# EAGLE design 7-saw-controller (EAGLE 6.4)
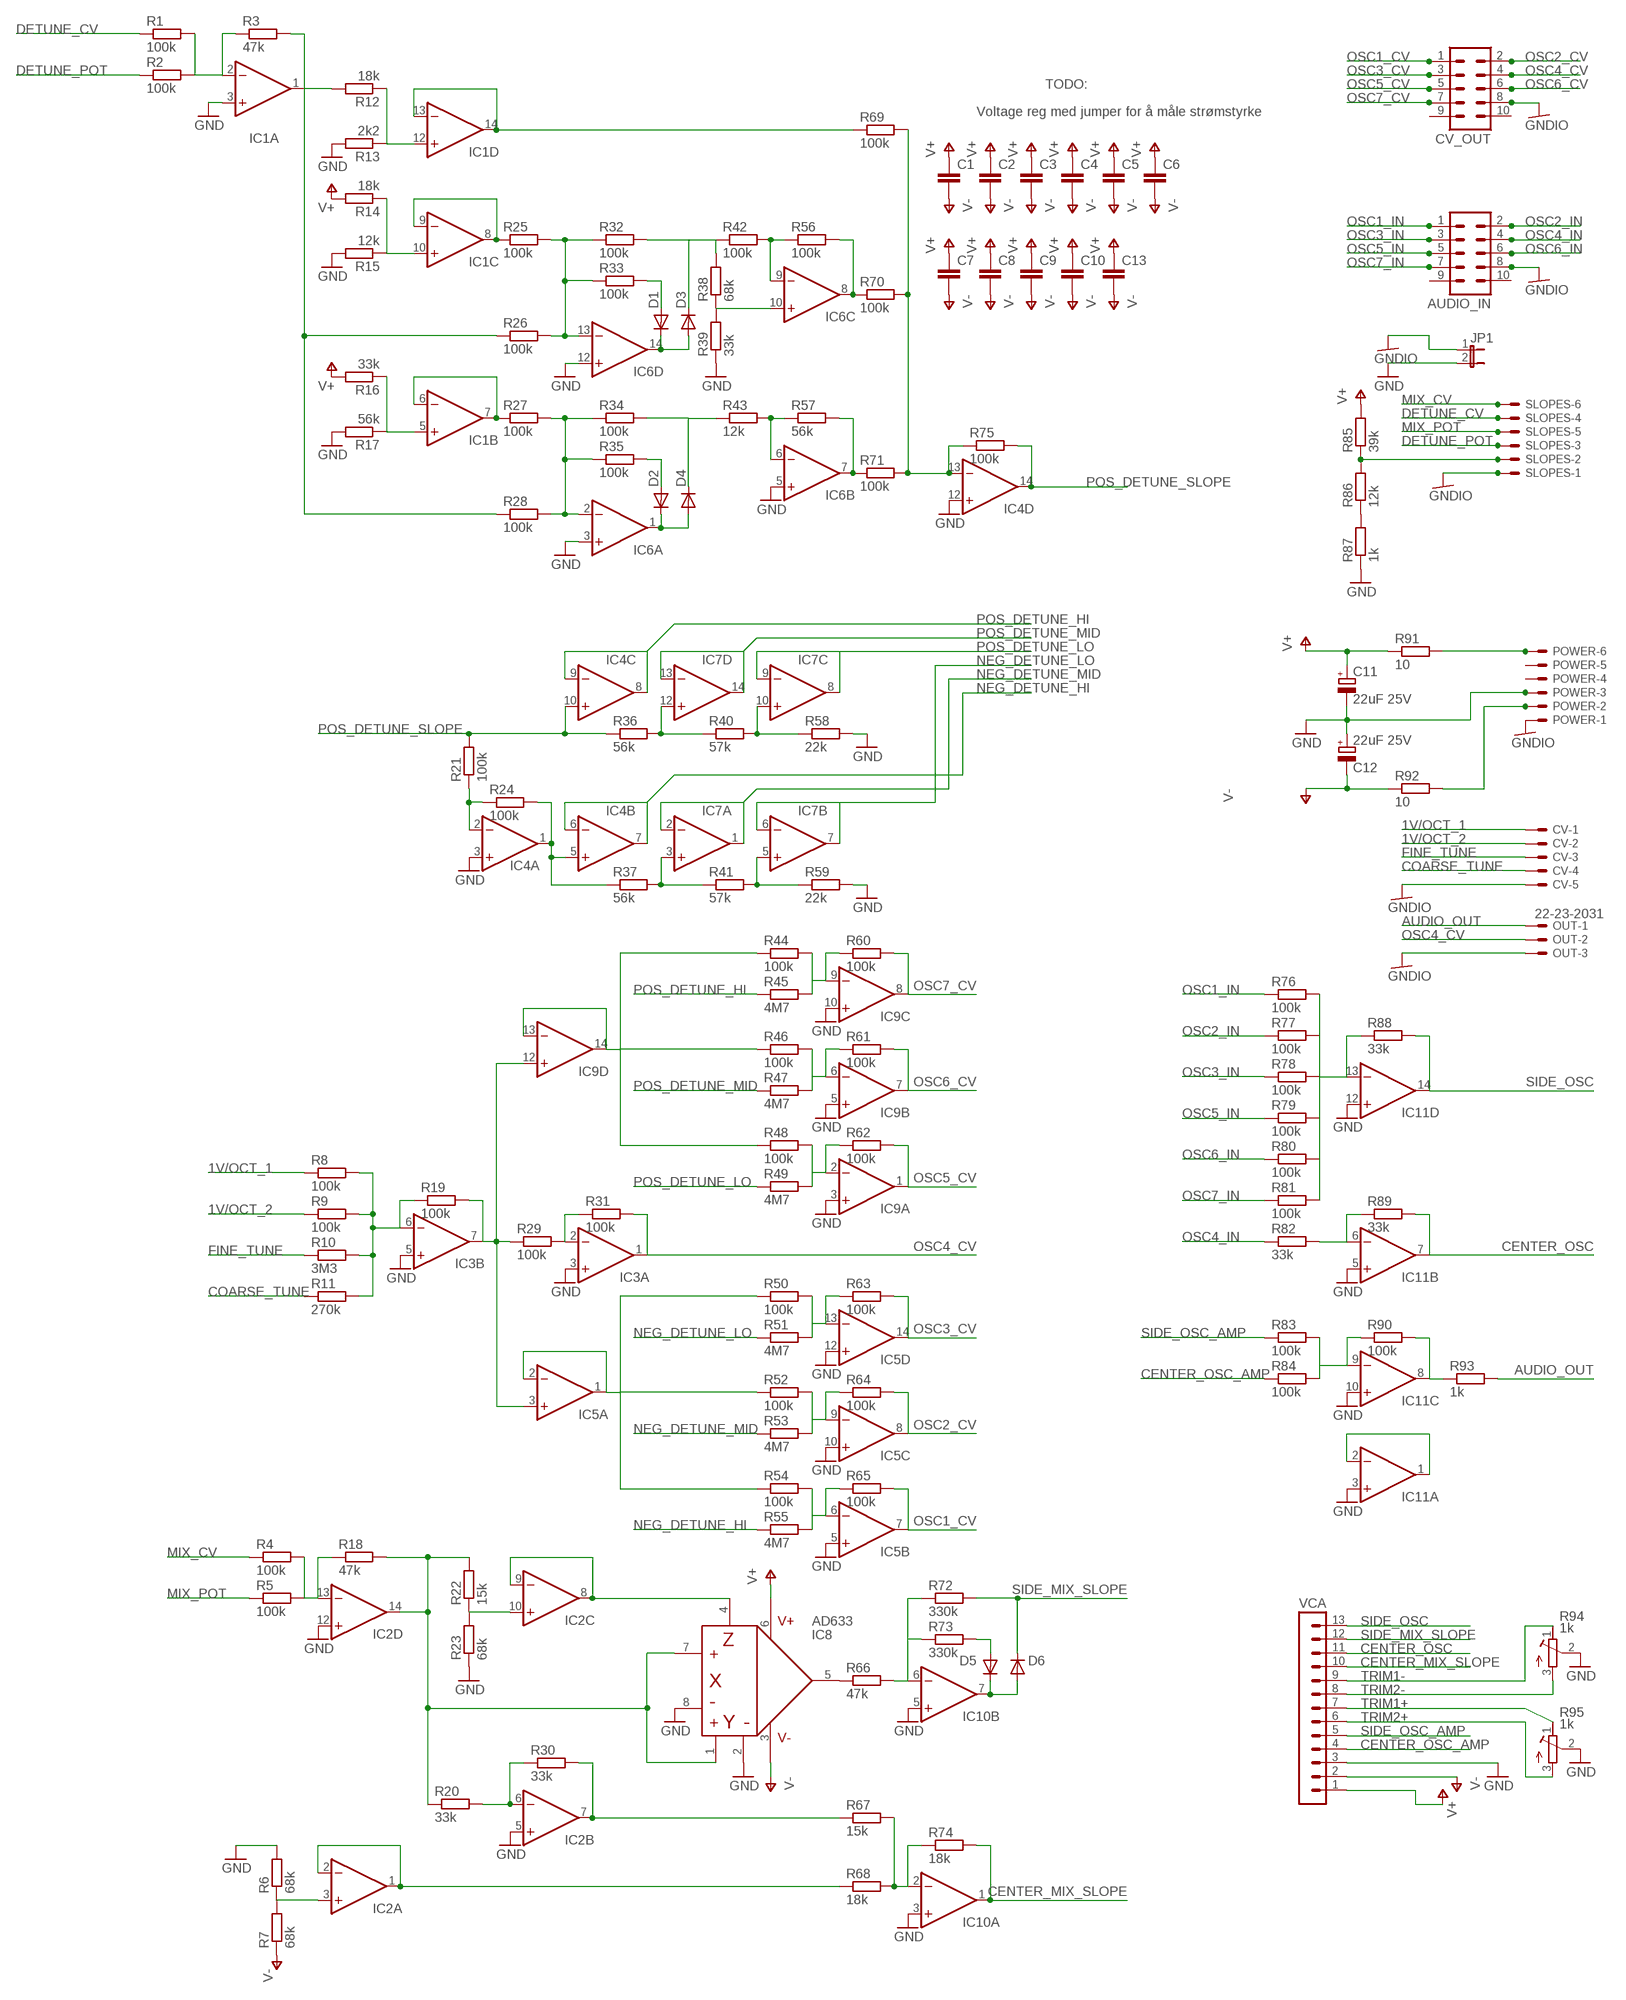
[diagram p0: schematic, sheet 1]

## Parts
AUDIO_IN  MA05-2  [MA05-2]
C1  C-EU025-024X044  [C025-024X044]
C2  C-EU025-024X044  [C025-024X044]
C3  C-EU025-024X044  [C025-024X044]
C4  C-EU025-024X044  [C025-024X044]
C5  C-EU025-024X044  [C025-024X044]
C6  C-EU025-024X044  [C025-024X044]
C7  C-EU025-024X044  [C025-024X044]
C8  C-EU025-024X044  [C025-024X044]
C9  C-EU025-024X044  [C025-024X044]
C10  C-EU025-024X044  [C025-024X044]
C11  22uF 25V  CPOL-EUE2-5  [E2-5]
C12  22uF 25V  CPOL-EUE2-5  [E2-5]
C13  C-EU025-024X044  [C025-024X044]
CV  22-23-2051  [22-23-2051]
CV_OUT  MA05-2  [MA05-2]
D1  DIODE-D-5  [D-5]
D2  DIODE-D-5  [D-5]
D3  DIODE-D-5  [D-5]
D4  DIODE-D-5  [D-5]
D5  DIODE-D-5  [D-5]
D6  DIODE-D-5  [D-5]
IC1  TL074D  [SO14]
IC2  TL074D  [SO14]
IC3  TL072D  [SO08]
IC4  TL074D  [SO14]
IC5  TL074D  [SO14]
IC6  TL074D  [SO14]
IC7  TL074D  [SO14]
IC8  AD633  [SO08]
IC9  TL074D  [SO14]
IC10  TL072D  [SO08]
IC11  TL074D  [SO14]
JP1  JP1E  [JP1]
OUT  22-23-2031  [22-23-2031]
POWER  22-23-2061  [22-23-2061]
R1  100k  R-EU_0204/5  [0204/5]
R2  100k  R-EU_0204/5  [0204/5]
R3  47k  R-EU_0204/5  [0204/5]
R4  100k  R-EU_0204/5  [0204/5]
R5  100k  R-EU_0204/5  [0204/5]
R6  68k  R-EU_0204/5  [0204/5]
R7  68k  R-EU_0204/5  [0204/5]
R8  100k  R-EU_0204/5  [0204/5]
R9  100k  R-EU_0204/5  [0204/5]
R10  3M3  R-EU_0204/5  [0204/5]
R11  270k  R-EU_0204/5  [0204/5]
R12  18k  R-EU_0204/5  [0204/5]
R13  2k2  R-EU_0204/5  [0204/5]
R14  18k  R-EU_0204/5  [0204/5]
R15  12k  R-EU_0204/5  [0204/5]
R16  33k  R-EU_0204/5  [0204/5]
R17  56k  R-EU_0204/5  [0204/5]
R18  47k  R-EU_0204/5  [0204/5]
R19  100k  R-EU_0204/5  [0204/5]
R20  33k  R-EU_0204/5  [0204/5]
R21  100k  R-EU_0204/5  [0204/5]
R22  15k  R-EU_0204/5  [0204/5]
R23  68k  R-EU_0204/5  [0204/5]
R24  100k  R-EU_0204/5  [0204/5]
R25  100k  R-EU_0204/5  [0204/5]
R26  100k  R-EU_0204/5  [0204/5]
R27  100k  R-EU_0204/5  [0204/5]
R28  100k  R-EU_0204/5  [0204/5]
R29  100k  R-EU_0204/5  [0204/5]
R30  33k  R-EU_0204/5  [0204/5]
R31  100k  R-EU_0204/5  [0204/5]
R32  100k  R-EU_0204/5  [0204/5]
R33  100k  R-EU_0204/5  [0204/5]
R34  100k  R-EU_0204/5  [0204/5]
R35  100k  R-EU_0204/5  [0204/5]
R36  56k  R-EU_0204/5  [0204/5]
R37  56k  R-EU_0204/5  [0204/5]
R38  68k  R-EU_0204/5  [0204/5]
R39  33k  R-EU_0204/5  [0204/5]
R40  57k  R-EU_0204/5  [0204/5]
R41  57k  R-EU_0204/5  [0204/5]
R42  100k  R-EU_0204/5  [0204/5]
R43  12k  R-EU_0204/5  [0204/5]
R44  100k  R-EU_0204/5  [0204/5]
R45  4M7  R-EU_0204/5  [0204/5]
R46  100k  R-EU_0204/5  [0204/5]
R47  4M7  R-EU_0204/5  [0204/5]
R48  100k  R-EU_0204/5  [0204/5]
R49  4M7  R-EU_0204/5  [0204/5]
R50  100k  R-EU_0204/5  [0204/5]
R51  4M7  R-EU_0204/5  [0204/5]
R52  100k  R-EU_0204/5  [0204/5]
R53  4M7  R-EU_0204/5  [0204/5]
R54  100k  R-EU_0204/5  [0204/5]
R55  4M7  R-EU_0204/5  [0204/5]
R56  100k  R-EU_0204/5  [0204/5]
R57  56k  R-EU_0204/5  [0204/5]
R58  22k  R-EU_0204/5  [0204/5]
R59  22k  R-EU_0204/5  [0204/5]
R60  100k  R-EU_0204/5  [0204/5]
R61  100k  R-EU_0204/5  [0204/5]
R62  100k  R-EU_0204/5  [0204/5]
R63  100k  R-EU_0204/5  [0204/5]
R64  100k  R-EU_0204/5  [0204/5]
R65  100k  R-EU_0204/5  [0204/5]
R66  47k  R-EU_0204/5  [0204/5]
R67  15k  R-EU_0204/5  [0204/5]
R68  18k  R-EU_0204/5  [0204/5]
R69  100k  R-EU_0204/5  [0204/5]
R70  100k  R-EU_0204/5  [0204/5]
R71  100k  R-EU_0204/5  [0204/5]
R72  330k  R-EU_0204/5  [0204/5]
R73  330k  R-EU_0204/5  [0204/5]
R74  18k  R-EU_0204/5  [0204/5]
R75  100k  R-EU_0204/5  [0204/5]
R76  100k  R-EU_0204/5  [0204/5]
R77  100k  R-EU_0204/5  [0204/5]
R78  100k  R-EU_0204/5  [0204/5]
R79  100k  R-EU_0204/5  [0204/5]
R80  100k  R-EU_0204/5  [0204/5]
R81  100k  R-EU_0204/5  [0204/5]
R82  33k  R-EU_0204/5  [0204/5]
R83  100k  R-EU_0204/5  [0204/5]
R84  100k  R-EU_0204/5  [0204/5]
R85  39k  R-EU_0204/5  [0204/5]
R86  12k  R-EU_0204/5  [0204/5]
R87  1k  R-EU_0204/5  [0204/5]
R88  33k  R-EU_0204/5  [0204/5]
R89  33k  R-EU_0204/5  [0204/5]
R90  100k  R-EU_0204/5  [0204/5]
R91  10  R-EU_0204/7  [0204/7]
R92  10  R-EU_0204/7  [0204/7]
R93  1k  R-EU_0204/5  [0204/5]
R94  1k  R-TRIMMT93YA  [RTRIMT93YA]
R95  1k  R-TRIMMT93YA  [RTRIMT93YA]
SLOPES  22-23-2061  [22-23-2061]
VCA  MA13-1  [MA13-1]

## Nets
1V/OCT_1: CV.1 R8.1
1V/OCT_2: CV.2 R9.1
AUDIO_OUT: OUT.1 R93.2
CENTER_MIX_SLOPE: IC10.1(A:OUT) R74.2 VCA.10
CENTER_OSC: IC11.7(B:OUT) R89.2 VCA.11
CENTER_OSC_AMP: R84.1 VCA.4
COARSE_TUNE: CV.4 R11.1
DETUNE_CV: R1.1 SLOPES.4
DETUNE_MIXED: R12.2 R26.1 R28.1
DETUNE_POT: R2.1 SLOPES.3
FINE_TUNE: CV.3 R10.1
GND: C11.- C12.+ IC1.3(A:+IN) IC2.5(B:+IN) IC2.12(D:+IN) IC3.3(A:+IN) IC3.5(B:+IN) IC4.3(A:+IN) IC4.12(D:+IN) IC5.5(B:+IN) IC5.10(C:+IN) IC5.12(D:+IN) IC6.3(A:+IN) IC6.5(B:+IN) IC6.12(D:+IN) IC8.2 IC8.8 IC9.3(A:+IN) IC9.5(B:+IN) IC9.10(C:+IN) IC10.3(A:+IN) IC10.5(B:+IN) IC11.3(A:+IN) IC11.5(B:+IN) IC11.10(C:+IN) IC11.12(D:+IN) JP1.2 POWER.3 R6.2 R13.2 R15.2 R17.2 R23.1 R39.1 R58.2 R59.2 R87.1 R94.2(S) R95.2(S) VCA.3
GNDIO: AUDIO_IN.8 CV.5 CV_OUT.8 JP1.1 OUT.3 POWER.1 SLOPES.1
MIX_CV: R4.1 SLOPES.6
MIX_POT: R5.1 SLOPES.5
N$1: IC1.12(D:+IN) R12.1 R13.1
N$2: IC1.13(D:-IN) IC1.14(D:OUT) R69.1
N$3: IC1.10(C:+IN) R14.1 R15.1
N$4: IC1.8(C:OUT) IC1.9(C:-IN) R25.1
N$5: IC6.13(D:-IN) R25.2 R26.2 R32.1 R33.1
N$6: IC6.7(B:OUT) R57.2 R71.1
N$7: IC10.2(A:-IN) R67.2 R68.2 R74.1
N$8: IC3.7(B:OUT) IC5.3(A:+IN) IC9.12(D:+IN) R19.2 R29.1
N$9: IC4.13(D:-IN) R69.2 R70.2 R71.2 R75.1
N$10: D1.A R33.2
N$11: D1.C D3.A IC6.14(D:OUT)
N$12: D3.C R32.2 R38.2 R42.1
N$13: IC2.14(D:OUT) IC8.1 IC8.7 R18.2 R20.1 R22.2
N$14: IC6.9(C:-IN) R42.2 R56.1
N$15: IC6.10(C:+IN) R38.1 R39.2
N$16: IC6.8(C:OUT) R56.2 R70.1
N$17: IC2.8(C:OUT) IC2.9(C:-IN) IC8.4
N$18: IC1.5(B:+IN) R16.1 R17.1
N$19: IC1.6(B:-IN) IC1.7(B:OUT) R27.1
N$20: IC2.10(C:+IN) R22.1 R23.2
N$21: IC6.2(A:-IN) R27.2 R28.2 R34.1 R35.1
N$22: D5.A R73.2
N$23: IC2.3(A:+IN) R6.1 R7.2
N$24: D2.A R35.2
N$25: D2.C D4.A IC6.1(A:OUT)
N$26: D4.C R34.2 R43.1
N$27: IC6.6(B:-IN) R43.2 R57.1
N$28: D5.C D6.A IC10.7(B:OUT)
N$29: IC2.1(A:OUT) IC2.2(A:-IN) R68.1
N$30: IC2.6(B:-IN) R20.2 R30.1
N$31: IC2.7(B:OUT) R30.2 R67.1
N$32: IC9.9(C:-IN) R44.2 R45.2 R60.1
N$33: IC5.13(D:-IN) R50.2 R51.2 R63.1
N$34: IC5.9(C:-IN) R52.2 R53.2 R64.1
N$35: IC8.5 R66.1
N$36: IC5.6(B:-IN) R54.2 R55.2 R65.1
N$37: IC10.6(B:-IN) R66.2 R72.1 R73.1
N$38: IC5.1(A:OUT) IC5.2(A:-IN) R50.1 R52.1 R54.1
N$39: IC9.6(B:-IN) R46.2 R47.2 R61.1
N$40: POWER.6 R91.2
N$41: IC9.13(D:-IN) IC9.14(D:OUT) R44.1 R46.1 R48.1
N$42: R85.1 R86.2 SLOPES.2
N$43: IC9.2(A:-IN) R48.2 R49.2 R62.1
N$44: POWER.2 R92.2
N$45: IC3.6(B:-IN) R8.2 R9.2 R10.2 R11.2 R19.1
N$46: IC11.13(D:-IN) R76.2 R77.2 R78.2 R79.2 R80.2 R81.2 R88.1
N$47: IC11.6(B:-IN) R82.2 R89.1
N$48: IC11.9(C:-IN) R83.2 R84.2 R90.1
N$49: IC1.1(A:OUT) R3.2
N$50: IC11.8(C:OUT) R90.2 R93.1
N$51: IC2.13(D:-IN) R4.2 R5.2 R18.1
N$52: IC7.12(D:+IN) R36.2 R40.1
N$53: IC7.10(C:+IN) R40.2 R58.1
N$54: IC4.1(A:OUT) IC4.5(B:+IN) R24.2 R37.1
N$55: IC1.2(A:-IN) R1.2 R2.2 R3.1
N$56: IC3.2(A:-IN) R29.2 R31.1
N$57: IC7.3(A:+IN) R37.2 R41.1
N$58: IC7.5(B:+IN) R41.2 R59.1
N$60: R86.1 R87.2
N$61: IC4.2(A:-IN) R21.1 R24.1
N$62: IC11.1(A:OUT) IC11.2(A:-IN)
NEG_DETUNE_HI: IC4.6(B:-IN) IC4.7(B:OUT) R55.1
NEG_DETUNE_LO: IC7.6(B:-IN) IC7.7(B:OUT) R51.1
NEG_DETUNE_MID: IC7.1(A:OUT) IC7.2(A:-IN) R53.1
OSC1_CV: CV_OUT.1 IC5.7(B:OUT) R65.2
OSC1_IN: AUDIO_IN.1 R76.1
OSC2_CV: CV_OUT.2 IC5.8(C:OUT) R64.2
OSC2_IN: AUDIO_IN.2 R77.1
OSC3_CV: CV_OUT.3 IC5.14(D:OUT) R63.2
OSC3_IN: AUDIO_IN.3 R78.1
OSC4_CV: CV_OUT.4 IC3.1(A:OUT) OUT.2 R31.2
OSC4_IN: AUDIO_IN.4 R82.1
OSC5_CV: CV_OUT.5 IC9.1(A:OUT) R62.2
OSC5_IN: AUDIO_IN.5 R79.1
OSC6_CV: CV_OUT.6 IC9.7(B:OUT) R61.2
OSC6_IN: AUDIO_IN.6 R80.1
OSC7_CV: CV_OUT.7 IC9.8(C:OUT) R60.2
OSC7_IN: AUDIO_IN.7 R81.1
POS_DETUNE_HI: IC4.8(C:OUT) IC4.9(C:-IN) R45.1
POS_DETUNE_LO: IC7.8(C:OUT) IC7.9(C:-IN) R49.1
POS_DETUNE_MID: IC7.13(D:-IN) IC7.14(D:OUT) R47.1
POS_DETUNE_SLOPE: IC4.10(C:+IN) IC4.14(D:OUT) R21.2 R36.1 R75.2
SIDE_MIX_SLOPE: D6.C R72.2 VCA.12
SIDE_OSC: IC11.14(D:OUT) R88.2 VCA.13
SIDE_OSC_AMP: R83.1 VCA.5
TRIM1+: R94.3(E) VCA.8
TRIM1-: R94.1(A) VCA.9
TRIM2+: R95.3(E) VCA.6
TRIM2-: R95.1(A) VCA.7
V+: C1.1 C2.1 C3.1 C4.1 C5.1 C6.1 C7.1 C8.1 C9.1 C10.1 C11.+ C13.1 IC8.6 R14.2 R16.2 R85.2 R91.1 VCA.1
V-: C1.2 C2.2 C3.2 C4.2 C5.2 C6.2 C7.2 C8.2 C9.2 C10.2 C12.- C13.2 IC8.3 R7.1 R92.1 VCA.2
Unconnected: AUDIO_IN.9 AUDIO_IN.10 CV_OUT.9 CV_OUT.10 POWER.4 POWER.5

## Notes on the sheet
- TODO:
- Voltage reg med jumper for å måle strømstyrke

## Power pins joined to a net without a drawn wire
V+: IC1.4(P:V+) IC2.4(P:V+) IC3.8(P:V+) IC4.4(P:V+) IC5.4(P:V+) IC6.4(P:V+) IC7.4(P:V+) IC9.4(P:V+) IC10.8(P:V+) IC11.4(P:V+)
V-: IC1.11(P:V-) IC2.11(P:V-) IC3.4(P:V-) IC4.11(P:V-) IC5.11(P:V-) IC6.11(P:V-) IC7.11(P:V-) IC9.11(P:V-) IC10.4(P:V-) IC11.11(P:V-)

## Library data of the parts
AUDIO_IN CV_OUT = con-lstb:MA05-2: PIN HEADER; OC_FARNELL: unknown; OC_NEWARK: unknown
C1-C10 C13 = resistor:C-EU: CAPACITOR, European symbol
C11 C12 = resistor:CPOL-EU: POLARIZED CAPACITOR, European symbol
CV = con-molex:22-23-2051: .100" (2.54mm) Center Header - 5 Pin
D1-D6 = diode:DIODE-: DIODE
IC1 IC2 IC4-IC7 IC9 IC11 = linear:TL074: OP AMP
IC3 IC10 = linear:TL072: OP AMP
IC8 = joakim:AD633: AD633 Multiplier (X*Y)/(10*Z)
JP1 = jumper:JP1E: JUMPER
OUT = con-molex:22-23-2031: .100" (2.54mm) Center Header - 3 Pin
POWER SLOPES = con-molex:22-23-2061: .100" (2.54mm) Center Header - 6 Pin
R1-R90 R93 = joakim:R-EU_: RESISTOR, European symbol
R91 R92 = resistor:R-EU_: RESISTOR, European symbol
R94 R95 = resistor:R-TRIMM: Trimm resistor
VCA = con-lstb:MA13-1: PIN HEADER

## Board
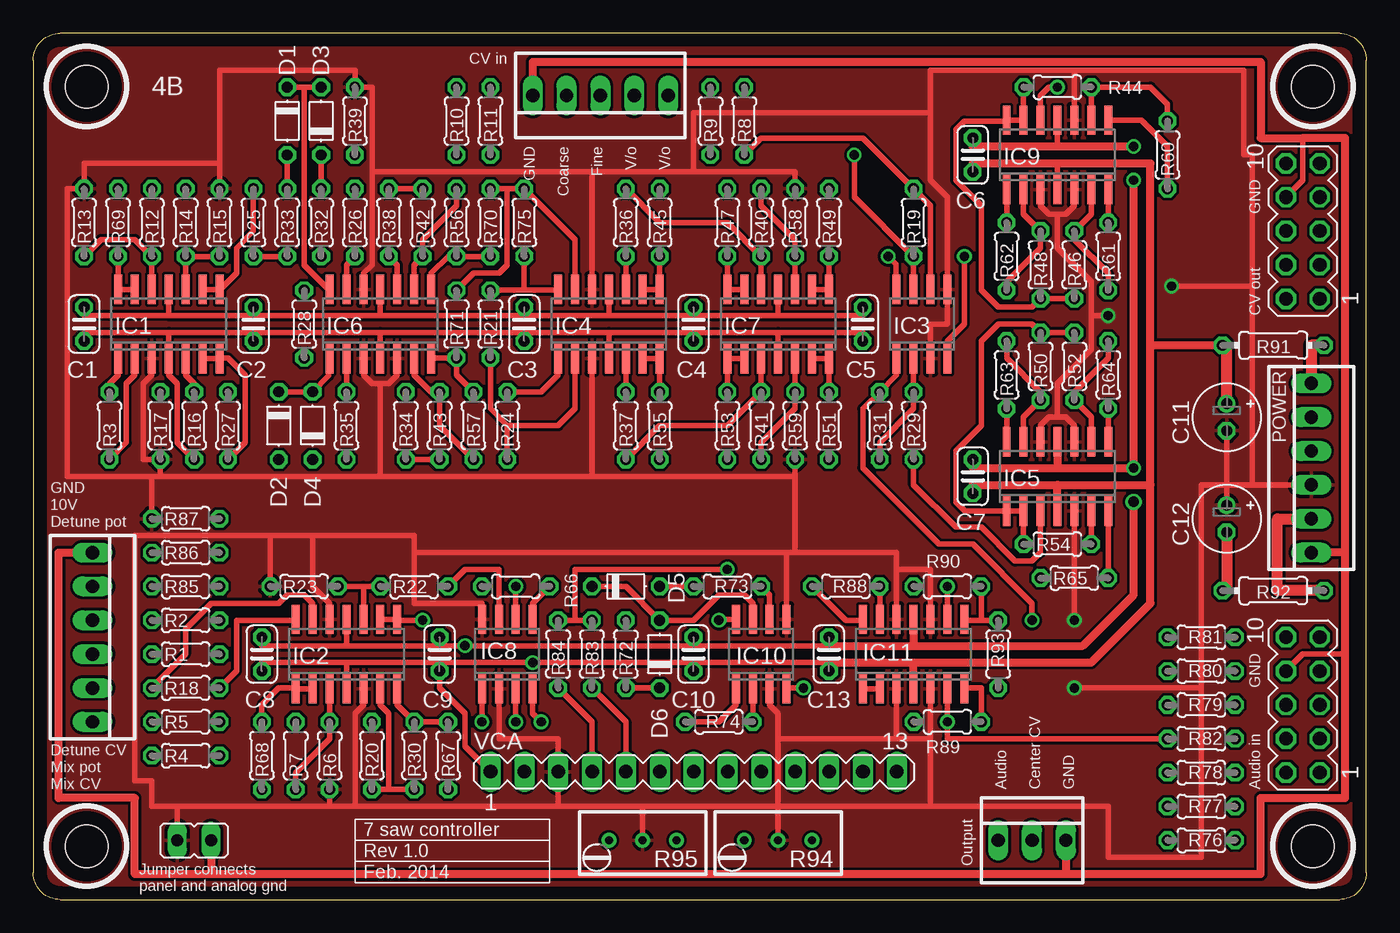
[diagram p1: board, top side]
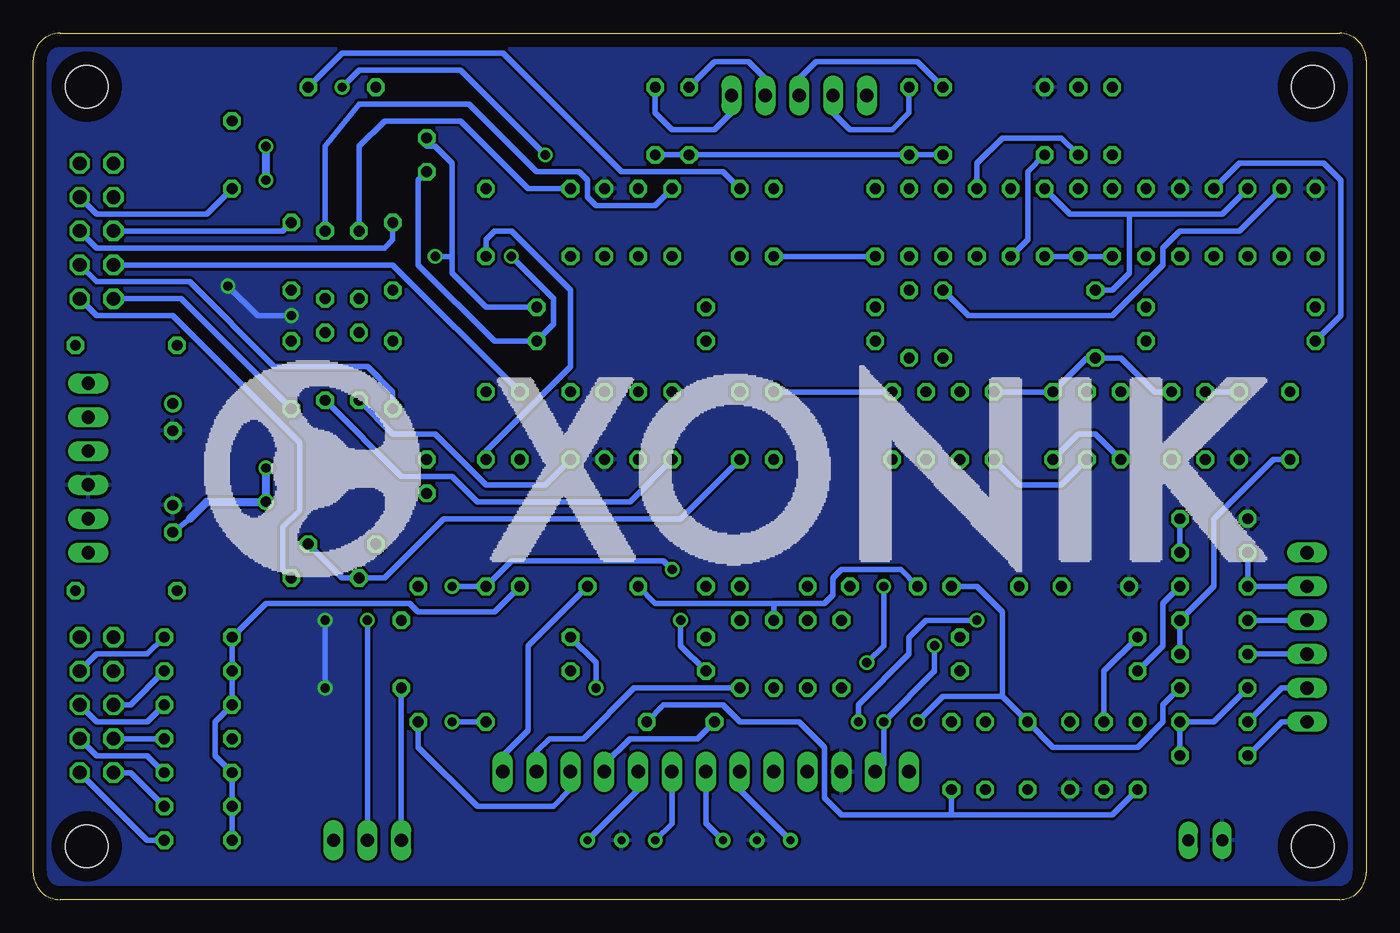
[diagram p2: board, bottom side, seen from below]

Size 100 x 65 mm. Coordinates in mm from the lower left corner, seen from the top.
Outline: 2,0 98,0 arc90 100,2 100,63 arc90 98,65 2,65 arc90 0,63 0,2 arc90 2,0
Copper layers (1*16): Top 0.035mm / dielectric 1.5mm / Bottom 0.035mm
Design rules "default": minimum track width 10mil, minimum drill 24mil, track to track 8mil, track to pad 8mil, pad to pad 8mil, via to via 8mil, smd to smd 8mil, copper to edge 40mil, drill to drill 8mil, minimum pad ring 10mil, minimum via ring 8mil, stop-mask expansion 4mil, vias tented up to drill 0mil, thermal gap 10mil
Holes 3.2 mm at 4,4 96,4 96,61 4,61

### Footprints (pad centres in the part's own frame; a part is rotated, then mirrored left to right if it is on the bottom)
MA05-2 = drill 1.016 octagon: 1 -5.08,-1.27; 2 -5.08,1.27; 3 -2.54,-1.27; 4 -2.54,1.27; 5 0,-1.27; 6 0,1.27; 7 2.54,-1.27; 8 2.54,1.27; 9 5.08,-1.27; 10 5.08,1.27
C025-024X044 = drill 0.813 octagon: 1 -1.27,0; 2 1.27,0
E2-5 = drill 0.813 pad 1.27: + -1.016,0 | drill 0.813 pad 1.27 octagon: - 1.016,0
22-23-2051 = drill 1 long: 1 -5.08,0; 2 -2.54,0; 3 0,0; 4 2.54,0; 5 5.08,0
D-5 = drill 0.813 octagon: A 2.54,0; C -2.54,0
SO14 = smd 0.6 x 2.2: 1 -3.81,-2.6; 2 -2.54,-2.6; 3 -1.27,-2.6; 4 0,-2.6; 5 1.27,-2.6; 6 2.54,-2.6; 7 3.81,-2.6; 8 3.81,2.6; 9 2.54,2.6; 10 1.27,2.6; 11 0,2.6; 12 -1.27,2.6; 13 -2.54,2.6; 14 -3.81,2.6
SO08 = smd 0.6 x 2.2: 1 -1.905,-2.6; 2 -0.635,-2.6; 3 0.635,-2.6; 4 1.905,-2.6; 5 1.905,2.6; 6 0.635,2.6; 7 -0.635,2.6; 8 -1.905,2.6
JP1 = drill 0.914 long: 1 0,-1.27; 2 0,1.27
22-23-2031 = drill 1 long: 1 -2.54,0; 2 0,0; 3 2.54,0
22-23-2061 = drill 1 long: 1 -6.35,0; 2 -3.81,0; 3 -1.27,0; 4 1.27,0; 5 3.81,0; 6 6.35,0
0204/5 = drill 0.813 octagon: 1 -2.54,0; 2 2.54,0
0204/7 = drill 0.813 octagon: 1 -3.81,0; 2 3.81,0
RTRIMT93YA = drill 0.61: 1 0,-2.54; 2 0,0; 3 0,2.54
MA13-1 = drill 1.016 long: 1 -15.24,0; 2 -12.7,0; 3 -10.16,0; 4 -7.62,0; 5 -5.08,0; 6 -2.54,0; 7 0,0; 8 2.54,0; 9 5.08,0; 10 7.62,0; 11 10.16,0; 12 12.7,0; 13 15.24,0

### Placement (x,y rotation side)
AUDIO_IN  95.25,14.61 90 top
C1  3.81,43.18 90 top
C2  16.51,43.18 90 top
C3  36.83,43.18 90 top
C4  49.53,43.18 90 top
C5  62.23,43.18 90 top
C6  70.48,55.88 90 top
C7  70.48,31.75 90 top
C8  17.14,18.41 90 top
C9  30.48,18.41 90 top
C10  49.53,18.41 90 top
C11  89.53,36.2 270 top
C12  89.53,28.57 270 top
C13  59.69,18.41 90 top
CV  42.55,60.33 180 top
CV_OUT  95.25,50.16 90 top
D1  19.05,58.42 270 top
D2  18.41,35.56 270 top
D3  21.59,58.42 90 top
D4  20.95,35.56 90 top
D5  44.45,23.5 0 top
D6  46.99,18.41 90 top
IC1  10.16,43.18 0 top
IC2  23.5,18.41 0 top
IC3  66.67,43.18 0 top
IC4  43.18,43.18 0 top
IC5  76.83,31.75 0 top
IC6  26.04,43.18 0 top
IC7  55.88,43.18 0 top
IC8  35.56,18.41 0 top
IC9  76.83,55.88 0 top
IC10  54.61,18.41 0 top
IC11  66.04,18.41 0 top
JP1  12.06,4.45 90 top
OUT  74.93,4.45 0 top
POWER  95.89,32.38 90 top
R1  11.43,18.41 0 top
R2  11.43,20.95 0 top
R3  5.71,35.56 90 top
R4  11.43,10.79 0 top
R5  11.43,13.34 0 top
R6  22.23,10.79 270 top
R7  19.68,10.79 270 top
R8  53.34,58.42 270 top
R9  50.8,58.42 270 top
R10  31.75,58.42 270 top
R11  34.29,58.42 270 top
R12  8.89,50.8 90 top
R13  3.81,50.8 90 top
R14  11.43,50.8 90 top
R15  13.97,50.8 90 top
R16  12.06,35.56 270 top
R17  9.53,35.56 270 top
R18  11.43,15.88 0 top
R19  66.04,50.8 270 top
R20  25.4,10.79 270 top
R21  34.29,43.18 90 top
R22  28.57,23.5 0 top
R23  20.32,23.5 0 top
R24  35.56,35.56 90 top
R25  16.51,50.8 270 top
R26  24.13,50.8 270 top
R27  14.61,35.56 90 top
R28  20.32,43.18 270 top
R29  66.04,35.56 90 top
R30  28.57,10.79 90 top
R31  63.5,35.56 90 top
R32  21.59,50.8 90 top
R33  19.05,50.8 90 top
R34  27.94,35.56 270 top
R35  23.5,35.56 270 top
R36  44.45,50.8 90 top
R37  44.45,35.56 270 top
R38  26.67,50.8 90 top
R39  24.13,58.42 270 top
R40  54.61,50.8 90 top
R41  54.61,35.56 270 top
R42  29.21,50.8 270 top
R43  30.48,35.56 90 top
R44  76.83,60.96 0 top
R45  46.99,50.8 90 top
R46  78.11,47.62 90 top
R47  52.07,50.8 90 top
R48  75.56,47.62 90 top
R49  59.69,50.8 90 top
R50  75.56,40.01 270 top
R51  59.69,35.56 270 top
R52  78.11,40.01 270 top
R53  52.07,35.56 270 top
R54  76.83,26.67 0 top
R55  46.99,35.56 270 top
R56  31.75,50.8 270 top
R57  33.02,35.56 90 top
R58  57.15,50.8 90 top
R59  57.15,35.56 270 top
R60  85.09,55.88 270 top
R61  80.64,48.26 90 top
R62  73.03,48.26 90 top
R63  73.03,39.37 270 top
R64  80.64,39.37 270 top
R65  78.11,24.13 0 top
R66  36.2,23.5 180 top
R67  31.11,10.79 270 top
R68  17.14,10.79 270 top
R69  6.35,50.8 90 top
R70  34.29,50.8 90 top
R71  31.75,43.18 90 top
R72  44.45,18.41 270 top
R73  52.07,23.5 180 top
R74  51.44,13.34 180 top
R75  36.83,50.8 270 top
R76  87.63,4.45 180 top
R77  87.63,6.99 180 top
R78  87.63,9.53 180 top
R79  87.63,14.61 180 top
R80  87.63,17.14 180 top
R81  87.63,19.68 180 top
R82  87.63,12.06 180 top
R83  41.91,18.41 90 top
R84  39.37,18.41 90 top
R85  11.43,23.5 0 top
R86  11.43,26.04 180 top
R87  11.43,28.57 0 top
R88  60.96,23.5 180 top
R89  68.58,13.34 0 top
R90  68.58,23.5 0 top
R91  93.03,41.59 0 top
R92  93.03,23.18 0 top
R93  72.39,18.41 270 top
R94  55.88,4.45 90 top
R95  45.72,4.45 90 top
SLOPES  4.45,19.68 270 top
VCA  49.55,9.59 0 top

### Tracks (layer width: path | path; a pad name or v marks a point on that pad's centre or on a via)
1V/OCT_1
  Bottom 0.406: CV.1 47.62,59.05 48.9,57.78 52.07,57.78 53.34,59.05 R8.1
1V/OCT_2
  Bottom 0.406: CV.2 45.09,61.59 46.35,62.87 48.9,62.87 R9.1
AUDIO_OUT
  Bottom 0.406: R93.2 OUT.1
CENTER_MIX_SLOPE
  Top 0.406: IC10.1 52.7,14.61 51.44,13.34 R74.2
  Bottom 0.406: R74.2 50.16,12.06 55.24,12.06 57.16,10.14 VCA.10
CENTER_OSC
  Top 0.406: R89.2 71.12,15.88 69.85,15.88 IC11.7
  Bottom 0.406: R89.2 71.12,11.43 66.67,6.99 60.96,6.99 59.69,8.3 VCA.11
CENTER_OSC_AMP
  Top 0.406: R84.1 41.91,13.34 41.91,9.6 VCA.4
COARSE_TUNE
  Bottom 0.406: CV.4 40.01,59.05 38.73,57.78 35.56,57.78 34.29,59.05 R11.1
DETUNE_CV
  Bottom 0.406: SLOPES.4 R1.1
DETUNE_MIXED
  Bottom 0.406: R12.2 10.79,51.44 17.78,51.44 | 17.78,51.44 22.23,51.44 R26.1 | R28.1 19.05,45.72 17.78,46.99 17.78,51.44
DETUNE_POT
  Bottom 0.406: SLOPES.3 R2.1
FINE_TUNE
  Bottom 0.406: R10.1 33.66,62.87 41.27,62.87 42.55,61.59 CV.3
GND  (via drill 0.7)
  Top 0.406: 89.53,31.11 C12.+ | IC1.3 8.89,39.37 8.26,38.73 8.26,33.02 R17.2 9.53,31.75 | 8.89,31.75 2.54,31.75 2.54,53.34 R13.2 3.81,55.24 13.97,55.24 | 8.89,31.75 9.53,31.75 | 9.53,31.75 26.04,31.75 | 26.04,31.75 26.04,38.73 | IC2.12 22.23,22.23 20.95,23.5 20.95,27.3 | IC6.5 27.3,39.37 26.67,38.73 26.04,38.73 | IC6.3 24.77,39.37 25.4,38.73 26.04,38.73 | IC6.12 24.77,46.99 25.4,47.62 25.4,54.61 | IC4.3 41.91,31.75 | 41.91,31.75 26.04,31.75 | 41.91,31.75 57.15,31.75 | 57.15,31.75 R59.2 | IC4.12 41.91,54.61 | 41.91,54.61 25.4,54.61 | 25.4,54.61 25.4,60.96 R39.1 24.13,62.23 13.97,62.23 13.97,55.24 | R15.2 13.97,55.24 | 39.37,6.99 39.38,7 VCA.3 39.37,9.6 39.37,12.06 34.92,12.06 IC8.2 | 78.11,62.23 67.31,62.23 67.31,59.05 | R58.2 57.15,54.61 49.53,54.61 | 49.53,54.61 41.91,54.61 | 67.31,59.05 67.31,53.98 68.58,52.7 IC3.5 68.58,43.18 67.31,43.18 IC3.3 | 67.31,59.05 49.53,59.05 49.53,54.61 | IC9.5 78.11,52.07 77.47,51.44 76.83,51.44 | 76.83,51.44 76.2,51.44 75.56,52.07 IC9.3 | IC5.12 75.56,35.56 76.2,36.2 76.83,36.2 | IC5.10 78.11,35.56 77.47,36.2 76.83,36.2 | 76.83,36.2 76.83,38.73 79.38,41.27 79.38,43.81 | 76.83,51.44 76.83,48.9 79.38,46.35 79.38,43.81 | 78.11,23.5 IC5.5 v78.11,20.95 | 28.57,26.04 28.57,22.23 33.66,22.23 IC8.8 | 20.95,27.3 28.57,27.3 28.57,26.04 | R6.2 22.23,6.99 | 24.13,6.99 39.37,6.99 | 39.37,6.99 45.72,6.99 | 45.72,6.99 55.88,6.99 | IC2.5 24.77,14.61 24.13,13.97 24.13,6.99 | R95.2 45.72,6.99 | R94.2 55.88,6.99 | 55.88,6.99 55.88,12.06 | 55.88,12.06 55.88,13.97 55.24,14.61 IC10.3 | IC11.5 67.31,12.06 | 67.31,12.06 67.31,6.99 | 67.31,6.99 55.88,6.99 | IC11.10 67.31,24.77 64.77,24.77 | 57.15,26.04 64.77,26.04 64.77,24.77
  Top 0.406: 57.15,26.04 56.52,26.04 | 56.52,26.04 28.57,26.04 | IC11.12 64.77,24.77 | IC10.5 56.52,26.04 | 57.15,31.75 57.15,26.04 | 64.77,12.06 55.88,12.06 | IC11.3 64.77,12.06 | 64.77,12.06 67.31,12.06 | 17.78,27.3 7.62,27.3 7.62,8.89 8.89,8.89 8.89,6.99 10.79,6.99 | 10.79,6.99 22.23,6.99 | R23.1 17.78,27.3 | 87.63,15.88 87.63,31.11 89.53,31.11 | 87.63,15.88 87.63,3.17 80.64,3.17 80.64,6.99 67.31,6.99 | C11.- 89.53,31.11 | POWER.3 91.44,31.11 | 91.44,31.11 89.53,31.11 | IC9.10 78.11,62.23 | 78.11,62.23 90.81,62.23 90.81,55.88 91.44,55.88 91.44,46.04 | 91.44,46.04 91.44,31.11 | R87.1 8.89,31.75 | 79.38,43.81 v80.64,43.81 | v85.41,46.04 91.44,46.04 | JP1.2 10.79,6.99 | v78.11,15.88 87.63,15.88 | 20.95,27.3 17.78,27.3 | 22.23,6.99 24.13,6.99
  Bottom 0.406: v80.64,43.81 83.19,43.81 v85.41,46.04 | v78.11,20.95 v78.11,15.88
  pour Top: 0,65.02 100.08,65.02 100.08,0 0,0
  pour Bottom: -0.25,65.41 100.14,65.41 arc-90 100.46,65.09 100.46,-0.25 -0.06,-0.25 arc-90 -0.38,0.06 -0.38,65.41
GNDIO
  Top 0.406: 98.42,18.41 95.25,18.41 AUDIO_IN.8 | 95.25,57.15 95.25,53.98 CV_OUT.8
  Top 0.61: 98.42,26.04 98.42,57.15 95.25,57.15 92.08,57.15 92.08,62.87 37.47,62.87 CV.5 | 98.42,26.04 98.42,18.41 98.42,7.62 92.08,7.62 92.08,1.91 77.47,1.91 | 98.42,26.04 POWER.1 | 77.47,1.91 13.34,1.91 | 13.34,1.91 7.62,1.91 7.62,7.62 1.91,7.62 1.91,26.04 SLOPES.1 | OUT.3 77.47,1.91 | JP1.1 13.34,1.91
MIX_CV
  Bottom 0.406: SLOPES.6 6.35,13.34 R4.1
MIX_POT
  Bottom 0.406: SLOPES.5 6.35,15.88 R5.1
N$1
  Top 0.406: IC1.12 R12.1 7.62,49.53 5.08,49.53 R13.1
N$2
  Top 0.406: IC1.13 IC1.14 R69.1
N$3
  Top 0.406: IC1.10 R14.1 R15.1
N$4
  Top 0.406: IC1.9 IC1.8 14.03,45.78 15.24,46.99 15.24,48.9 16.51,50.16 R25.1
N$5
  Top 0.406: R26.2 23.5,47.62 IC6.13 | R33.1 R25.2
  Bottom 0.406: R26.2 R32.1 R33.1
N$6
  Top 0.406: R57.2 31.75,39.37 R71.1 29.91,40.64 IC6.7
N$7
  Top 0.406: IC10.2 R74.1
  Bottom 0.406: R68.2 19.05,6.35 31.11,6.35 | R74.1 52.7,14.61 48.26,14.61 46.99,13.34 42.55,13.34 40.64,11.43 40.64,7.62 39.37,6.35 31.11,6.35 | 31.11,6.35 R67.2
N$8  (via drill 0.7)
  Top 0.406: v61.59,55.88 61.59,52.7 R19.2 IC3.7 | v76.83,60.96 76.2,60.96 75.56,60.33 IC9.12 | IC5.3 75.56,26.04 74.93,25.4 73.66,25.4 71.12,27.94 69.22,27.94 66.04,31.11 R29.1
  Bottom 0.406: v61.59,55.88 67.94,62.23 75.56,62.23 v76.83,60.96 | R19.2 66.04,49.53 65.41,50.16 64.14,50.16 59.69,45.72 59.69,40.01 66.04,33.66 R29.1
N$9
  Top 0.406: R71.2 33.02,46.99 34.92,46.99 35.56,47.62 35.56,53.34 | 35.56,53.34 R70.2 | IC4.13 40.64,49.53 R75.1 35.56,53.34
  Bottom 0.406: R69.2 9.53,50.16 13.97,50.16 15.24,48.9 15.24,47.62 19.05,43.81 29.84,43.81 R71.2
N$10
  Top 0.406: D1.A R33.2
N$11
  Top 0.406: D3.A 20.32,60.96 | 20.32,60.96 D1.C | IC6.14 22.16,45.78 20.32,47.62 20.32,60.96
N$12
  Top 0.406: D3.C R32.2 | R38.2 R42.1
  Bottom 0.406: R42.1 29.21,55.24 27.3,57.15 22.86,57.15 D3.C
N$13  (via drill 0.7)
  Top 0.406: 19.68,21.59 IC2.14 19.62,20.95 15.24,20.95 15.24,17.14 R18.2 | IC8.7 34.92,24.77 32.38,24.77 R22.2 | IC8.1 v33.66,13.34
  Bottom 0.406: R18.2 15.24,14.61 15.24,13.34 17.14,11.43 23.5,11.43 R20.1 27.3,15.24 | R22.2 29.21,23.5 27.3,21.59 27.3,15.24 | v33.66,13.34 31.75,15.24 27.3,15.24
N$14
  Top 0.406: IC6.9 28.57,47.62 R42.2 29.21,49.53 31.75,52.07 R56.1
N$15
  Top 0.406: R38.1 27.3,47.62 IC6.10
  Bottom 0.406: R38.1 25.4,49.53 25.4,54.61 R39.2
N$16
  Top 0.406: R70.1 R56.2 31.11,48.26 29.84,46.99 IC6.8
N$17  (via drill 0.7)
  Top 0.406: IC2.9 IC2.8 27.36,20.95 v29.21,20.95 | 37.52,15.88 IC8.4 37.47,13.97 v38.1,13.34
  Bottom 0.406: v38.1,13.34 38.1,14.61 34.29,18.41 34.29,19.68 33.02,20.95 v29.21,20.95
N$18
  Top 0.406: IC1.5 11.43,39.37 12.06,38.73 R16.1
  Bottom 0.406: R17.1 R16.1
N$19
  Top 0.406: IC1.6 IC1.7 14.03,40.64 14.61,40.64 15.88,39.37 15.88,34.29 R27.1
N$20
  Top 0.406: IC2.10 24.77,23.5 | 24.77,23.5 R22.1 | R23.2 24.77,23.5
N$21
  Top 0.406: IC6.2 R35.1
  Bottom 0.406: R27.2 15.88,38.1 18.41,40.64 R28.2 20.95,40.64 R35.1 R34.1
N$22
  Top 0.406: R73.2 D5.A
N$23
  Top 0.406: IC2.3 R6.1 22.23,12.06 19.68,9.53 R7.2
N$24
  Bottom 0.406: D2.A 20.32,34.92 21.59,34.92 R35.2
N$25
  Top 0.406: IC6.1 22.16,39.31 D4.A D2.C
N$26
  Top 0.406: R34.2 R43.1
  Bottom 0.406: D4.C 22.86,31.11 26.04,31.11 R34.2
N$27
  Top 0.406: IC6.6 28.57,39.37 29.84,38.1 R43.2 30.48,35.56 R57.1
N$28
  Top 0.406: D5.C 44.45,23.5 D6.A 49.53,20.95 51.44,22.86 53.34,22.86 53.98,22.23 IC10.7
N$29
  Top 0.406: R68.1 17.14,14.61 18.41,15.88 19.62,15.88 IC2.1 IC2.2
N$30
  Top 0.406: 26.67,8.26 R30.1 | IC2.6 26.04,14.61 26.67,13.97 26.67,8.26 | 26.67,8.26 R20.2
N$31
  Top 0.406: IC2.7 27.3,14.61 R30.2 R67.1
N$32
  Top 0.406: IC9.9 R44.2 83.82,60.96 85.09,59.69 R60.1
  Bottom 0.406: R45.2 48.26,54.61 55.88,54.61 64.77,63.5 76.83,63.5 R44.2
N$33
  Top 0.406: IC5.13 74.3,36.2 R50.2 75.56,38.1 73.03,40.64 R63.1
  Bottom 0.406: R50.2 73.03,34.92 69.85,34.92 66.04,31.11 61.59,31.11 R51.2
N$34
  Top 0.406: R64.1 80.64,40.64 78.11,38.1 R52.2 79.38,36.2 IC5.9
  Bottom 0.406: R53.2 55.24,29.84 66.67,29.84 68.58,31.75 72.39,31.75 R52.2
N$35
  Top 0.406: IC8.5 37.47,22.23 R66.1
N$36
  Top 0.406: R54.2 IC5.6
  Bottom 0.406: R54.2 76.83,24.13 R65.1 73.66,24.13 69.22,28.57 51.44,28.57 R55.2
N$37
  Top 0.406: IC10.6 55.24,22.86 R73.1
  Bottom 0.406: R66.2 34.92,24.77 39.37,24.77 40.01,24.13 40.01,22.86 40.64,22.23 44.45,22.23 | R73.1 53.34,22.23 44.45,22.23 | 44.45,22.23 R72.1
N$38
  Top 0.406: R54.1 IC5.2 IC5.1 69.91,29.15 69.22,29.84 69.22,33.66 71.12,35.56 71.12,41.91 72.39,43.18 74.93,43.18 R50.1 R52.1
N$39
  Top 0.406: R61.1 80.64,46.99 78.11,49.53 R46.2 79.38,51.44 IC9.6
  Bottom 0.406: R47.2 53.34,52.07 57.78,52.07 58.42,52.7 58.42,53.98 59.05,54.61 62.23,54.61 67.31,59.69 75.56,59.69 78.11,56.52 R46.2
N$40
  Top 0.813: R91.2 95.89,41.59 POWER.6
N$41
  Top 0.406: R44.1 IC9.13 IC9.14 72.97,58.42 69.85,58.42 69.22,57.78 69.22,53.98 71.12,52.07 71.12,45.72 72.39,44.45 74.93,44.45 R48.1 R46.1
N$42
  Bottom 0.406: SLOPES.2 R85.1 R86.2
N$43
  Top 0.406: IC9.2 74.3,51.44 R48.2 75.56,48.9 73.03,46.35 R62.1
  Bottom 0.406: R49.2 62.87,53.34 67.94,58.42 73.66,58.42 75.56,56.52 R48.2
N$44
  Top 0.813: R92.2 93.34,23.18 93.34,28.57 POWER.2
N$45
  Top 0.406: R8.2 54.61,57.15 62.23,57.15 R19.1 67.31,52.07 IC3.6
  Bottom 0.406: R10.2 R11.2 R9.2 R8.2
N$46
  Top 0.406: R88.1 IC11.13
  Bottom 0.406: R88.1 65.41,21.59 71.12,21.59 71.75,22.23 82.55,22.23 R81.2 R80.2 R79.2 86.36,13.34 86.36,10.79 R78.2 R77.2 R76.2
N$47  (via drill 0.7)
  Top 0.406: IC11.6 v68.58,13.34 68.58,12.06 R82.2
  Bottom 0.406: v68.58,13.34 R89.1
N$48  (via drill 0.7)
  Top 0.406: R84.2 40.64,20.95 | R83.2 40.64,20.95 | 40.64,20.95 40.64,24.77 v52.07,24.77 | v68.58,23.5 IC11.9
  Bottom 0.406: v52.07,24.77 52.7,25.4 64.14,25.4 R90.1 v68.58,23.5
N$49
  Top 0.406: R3.2 5.71,38.73 6.35,39.37 IC1.1
N$50
  Top 0.406: R90.2 71.12,20.95 | 71.12,20.95 69.91,20.95 IC11.8 | R93.1 71.12,20.95
N$51
  Top 0.406: IC2.13 20.95,22.23 20.32,22.86 19.05,22.86 18.41,22.23 13.34,22.23 11.43,20.32 11.43,18.41 R18.1
  Bottom 0.406: R18.1 11.43,13.34 R5.2 R4.2
N$52
  Top 0.406: IC7.12 R40.1 52.07,50.8 46.99,50.8 R36.2
N$53
  Top 0.406: IC7.10 R58.1 57.15,49.53 54.61,52.07 R40.2
N$54
  Top 0.406: IC4.1 39.37,39.37 38.1,38.1 R24.2 | IC4.5 R37.1
  Bottom 0.406: R37.1 R24.2
N$55
  Top 0.406: R3.1 6.99,34.29 6.99,38.73 7.62,39.37 IC1.2
  Bottom 0.406: R1.2 R2.2 11.43,23.5 11.43,28.57 6.99,33.02 R3.1
N$56
  Top 0.406: IC3.2 R29.2 66.04,36.83 63.5,34.29 R31.1
N$57
  Top 0.406: IC7.3 R41.1 52.07,35.56 46.99,35.56 R37.2
N$58
  Top 0.406: IC7.5 R59.1 57.15,36.83 54.61,34.29 R41.2
N$60
  Bottom 0.406: R86.1 R87.2
N$61
  Top 0.406: 35.56,35.56 39.37,35.56 40.64,36.83 IC4.2 | R21.1 34.29,36.83 35.56,35.56 | 35.56,35.56 R24.1
N$62
  Top 0.406: IC11.1 IC11.2
NEG_DETUNE_HI
  Top 0.406: IC4.6 IC4.7 R55.1
NEG_DETUNE_LO
  Top 0.406: R51.1 IC7.7 IC7.6
NEG_DETUNE_MID
  Top 0.406: R53.1 IC7.1 IC7.2
OSC1_CV
  Top 0.406: R65.2 IC5.7
  Bottom 0.406: R65.2 81.28,24.77 81.28,27.94 80.01,29.21 80.01,34.29 89.53,43.81 95.25,43.81 CV_OUT.1
OSC1_IN
  Bottom 0.406: R76.1 91.44,4.45 AUDIO_IN.1
OSC2_CV
  Top 0.406: IC5.8 R64.2
  Bottom 0.406: R64.2 88.9,45.09 CV_OUT.2
OSC2_IN
  Bottom 0.406: R77.1 92.71,9.53 AUDIO_IN.2
OSC3_CV
  Top 0.406: IC5.14 R63.2
  Bottom 0.406: R63.2 73.03,38.1 74.93,40.01 81.92,40.01 88.27,46.35 95.25,46.35 CV_OUT.3
OSC3_IN
  Bottom 0.406: R78.1 91.44,10.79 95.25,10.79 AUDIO_IN.3
OSC4_CV  (via drill 0.7)
  Top 0.406: IC3.1 64.77,39.37 R31.2 62.23,36.83 62.23,32.38 67.94,26.67 70.48,26.67 74.93,22.23 v74.93,20.95
  Bottom 0.406: R31.2 73.03,47.62 CV_OUT.4 | OUT.2 v74.93,20.95
OSC4_IN
  Bottom 0.406: R82.1 AUDIO_IN.4
OSC5_CV
  Top 0.406: R62.2 IC9.1
  Bottom 0.406: R62.2 73.03,49.53 73.66,48.9 95.25,48.9 CV_OUT.5
OSC5_IN
  Bottom 0.406: R79.1 91.44,13.34 95.25,13.34 AUDIO_IN.5
OSC6_CV
  Top 0.406: IC9.7 R61.2
  Bottom 0.406: R61.2 81.28,50.16 CV_OUT.6
OSC6_IN
  Bottom 0.406: R80.1 92.71,14.61 AUDIO_IN.6
OSC7_CV
  Top 0.406: IC9.8 83.12,58.48 85.09,56.52 R60.2
  Bottom 0.406: R60.2 87,51.44 95.25,51.44 CV_OUT.7
OSC7_IN
  Bottom 0.406: R81.1 91.44,18.41 95.25,18.41 AUDIO_IN.7
POS_DETUNE_HI
  Top 0.406: IC4.9 IC4.8 R45.1
POS_DETUNE_LO
  Top 0.406: R49.1 IC7.8 IC7.9
POS_DETUNE_MID
  Top 0.406: R47.1 IC7.14 IC7.13
POS_DETUNE_SLOPE
  Top 0.406: R75.2 36.83,45.72 | IC4.10 R36.1 | R21.2 36.83,45.72 | 36.83,45.72 39.31,45.72 | 39.31,45.72 IC4.14 39.37,45.72 39.31,45.72
  Bottom 0.406: R75.2 R36.1
SIDE_MIX_SLOPE
  Top 0.406: R72.2 D6.C
  Bottom 0.406: D6.C 54.93,15.88 58.74,12.06 61.28,12.06 62.23,11.11 62.23,9.6 VCA.12
SIDE_OSC
  Top 0.406: R88.2 60.96,20.95 62.17,20.95 IC11.14
  Bottom 0.406: VCA.13 64.78,10.78 62.87,12.7 62.87,19.05 R88.2
SIDE_OSC_AMP
  Top 0.406: R83.1 44.45,13.34 44.45,9.6 VCA.5
TRIM1+
  Bottom 0.406: VCA.8 52.09,5.7 R94.3
TRIM1-
  Bottom 0.406: VCA.9 54.62,8.24 R94.1
TRIM2+
  Bottom 0.406: VCA.6 47.01,8.27 R95.3
TRIM2-
  Bottom 0.406: R95.1 49.53,5.71 49.53,7.67 VCA.7
V+  (via drill 0.7)
  Top 0.406: 10.16,42.55 IC1.4 10.16,39.37 10.79,38.73 10.79,34.29 R16.2 | 10.16,42.55 16.51,42.55 | 16.51,42.55 26.04,42.55 | 26.04,42.55 36.83,42.55 | 36.83,42.55 43.18,42.55 | 43.18,42.55 49.53,42.55 | 49.53,42.55 55.88,42.55 | 55.88,42.55 62.23,42.55 C5.1 | IC7.4 55.88,42.55 | C4.1 49.53,42.55 | C2.1 16.51,42.55 | IC6.4 26.04,42.55 | C1.1 3.81,42.55 10.16,42.55 | 76.83,55.24 IC9.4 | C7.1 70.48,31.11 | C6.1 70.48,55.24 | C8.1 17.14,17.78 23.5,17.78 | 23.5,17.78 30.48,17.78 | 30.48,17.78 v37.47,17.78 49.53,17.78 | 49.53,17.78 59.69,17.78 C13.1 | C10.1 49.53,17.78 | 30.48,17.78 C9.1 30.48,15.88 32.38,13.97 32.38,11.51 VCA.1 | IC10.8 52.01,21.02 v51.44,20.95 | IC3.8 64.71,47.69 v64.14,48.26 | 89.53,41.59 R91.1 | IC2.4 23.5,17.78 | C3.1 36.83,42.55 | IC4.4 43.18,42.55 | IC8.6 v36.2,23.5
  Top 0.61: 70.48,55.24 76.83,55.24 83.82,55.24 83.82,41.59 | 70.48,31.11 76.83,31.11 | IC5.4 76.83,31.11 | 76.83,31.11 83.82,31.11 | 59.69,17.78 66.04,17.78 | IC11.4 66.04,17.78 | 83.82,31.11 83.82,41.59 | 66.04,17.78 79.38,17.78 83.82,22.23 83.82,31.11 | 83.82,41.59 R91.1
  Top 0.813: C11.+ 89.53,41.59
  Bottom 0.406: v51.44,20.95 51.44,19.05 C10.1 | v64.14,48.26 60.96,45.09 60.96,43.18 C5.1 65.41,41.91 71.12,47.62 71.12,53.98 C6.1 | R14.2 9.53,55.24 3.17,55.24 1.91,53.98 1.91,43.81 C1.1 | v36.2,23.5 36.2,19.05 v37.47,17.78 | R85.2 15.24,22.23 15.24,19.05 C8.1
V-  (via drill 0.7, 0.8)
  Top 0.406: IC1.11 10.16,43.81 | 10.16,43.81 16.51,43.81 | 16.51,43.81 26.04,43.81 | 26.04,43.81 36.83,43.81 | 36.83,43.81 43.18,43.81 | 43.18,43.81 49.53,43.81 | 49.53,43.81 55.88,43.81 | 55.88,43.81 62.23,43.81 C5.2 | IC7.11 55.88,43.81 | C4.2 49.53,43.81 | C2.2 16.51,43.81 | IC6.11 26.04,43.81 | 10.16,43.81 3.81,43.81 C1.2 | 76.83,56.52 IC9.11 | C7.2 70.48,32.38 | C6.2 70.48,56.52 | C8.2 17.14,19.05 23.5,19.05 | 23.5,19.05 30.48,19.05 | 30.48,19.05 v32.38,19.05 49.53,19.05 | 49.53,19.05 59.69,19.05 C13.2 | IC2.11 23.5,19.05 | C9.2 30.48,19.05 | C10.2 49.53,19.05 | 68.58,40.64 IC3.4 68.58,41.91 69.85,43.18 v69.85,48.26 | 89.53,23.18 R92.1 | C3.2 36.83,43.81 | IC4.11 43.18,43.81 | IC8.3 v36.2,13.34 | v57.78,15.88 56.58,15.88 IC10.4
  Top 0.61: 70.48,56.52 76.83,56.52 v82.55,56.52 | 70.48,32.38 76.83,32.38 | IC5.11 76.83,32.38 | 76.83,32.38 v82.55,32.38 v82.55,53.98 | 59.69,19.05 66.04,19.05 | IC11.11 66.04,19.05 | 66.04,19.05 78.74,19.05 82.55,22.86 v82.55,29.84
  Top 0.813: C12.- 89.53,23.18
  Bottom 0.406: v57.78,15.88 57.78,17.78 C13.2 | v32.38,19.05 32.38,17.14 v36.2,13.34 36.2,10.16 VCA.2 | 68.58,48.26 68.58,55.24 69.85,56.52 70.48,56.52 C6.2 | v69.85,48.26 68.58,48.26 | 68.58,48.26 68.58,46.99 66.04,44.45 C5.2 | C12.- 88.27,28.57 | R7.1 19.68,17.14 C8.2
  Bottom 0.61: v82.55,53.98 v82.55,56.52 | v82.55,32.38 v82.55,29.84 87,29.84 88.27,28.57

### Text on the board
tNames: CV in | 4B | GND | Coarse | Fine | V/o | V/o | GND | CV out | GND | 10V | Detune pot | GND | Detune CV | Mix pot | Mix CV | Audio | Center CV | GND | Audio in | 7 saw controller | Rev 1.0 | Output | Feb. 2014 | Jumper connects / panel and analog gnd